# Altium schematic sheet dv_mcu.SchDoc: =GlobalProjectName
size 410 x 297 mm; SheetNumber: 1; SheetTotal: 6; PageSetup: Record=PageOptions|CenterHorizontal=True|CenterVertical=True|PrintScale=1.00|XCorrection=1.00|YCorrection=1.00|PrintKind=1|BorderSize=5000000|LeftOffset=0|BottomOffset=0|Orientation=2|PaperLength=1000|PaperWidth=1000|Scale=100|PaperSource=15|PrintQuality=1200|MediaType=1|DitherType=10|PaperKind=A3|PrintScaleMode=1; Weight: -; ScaleFactor: -
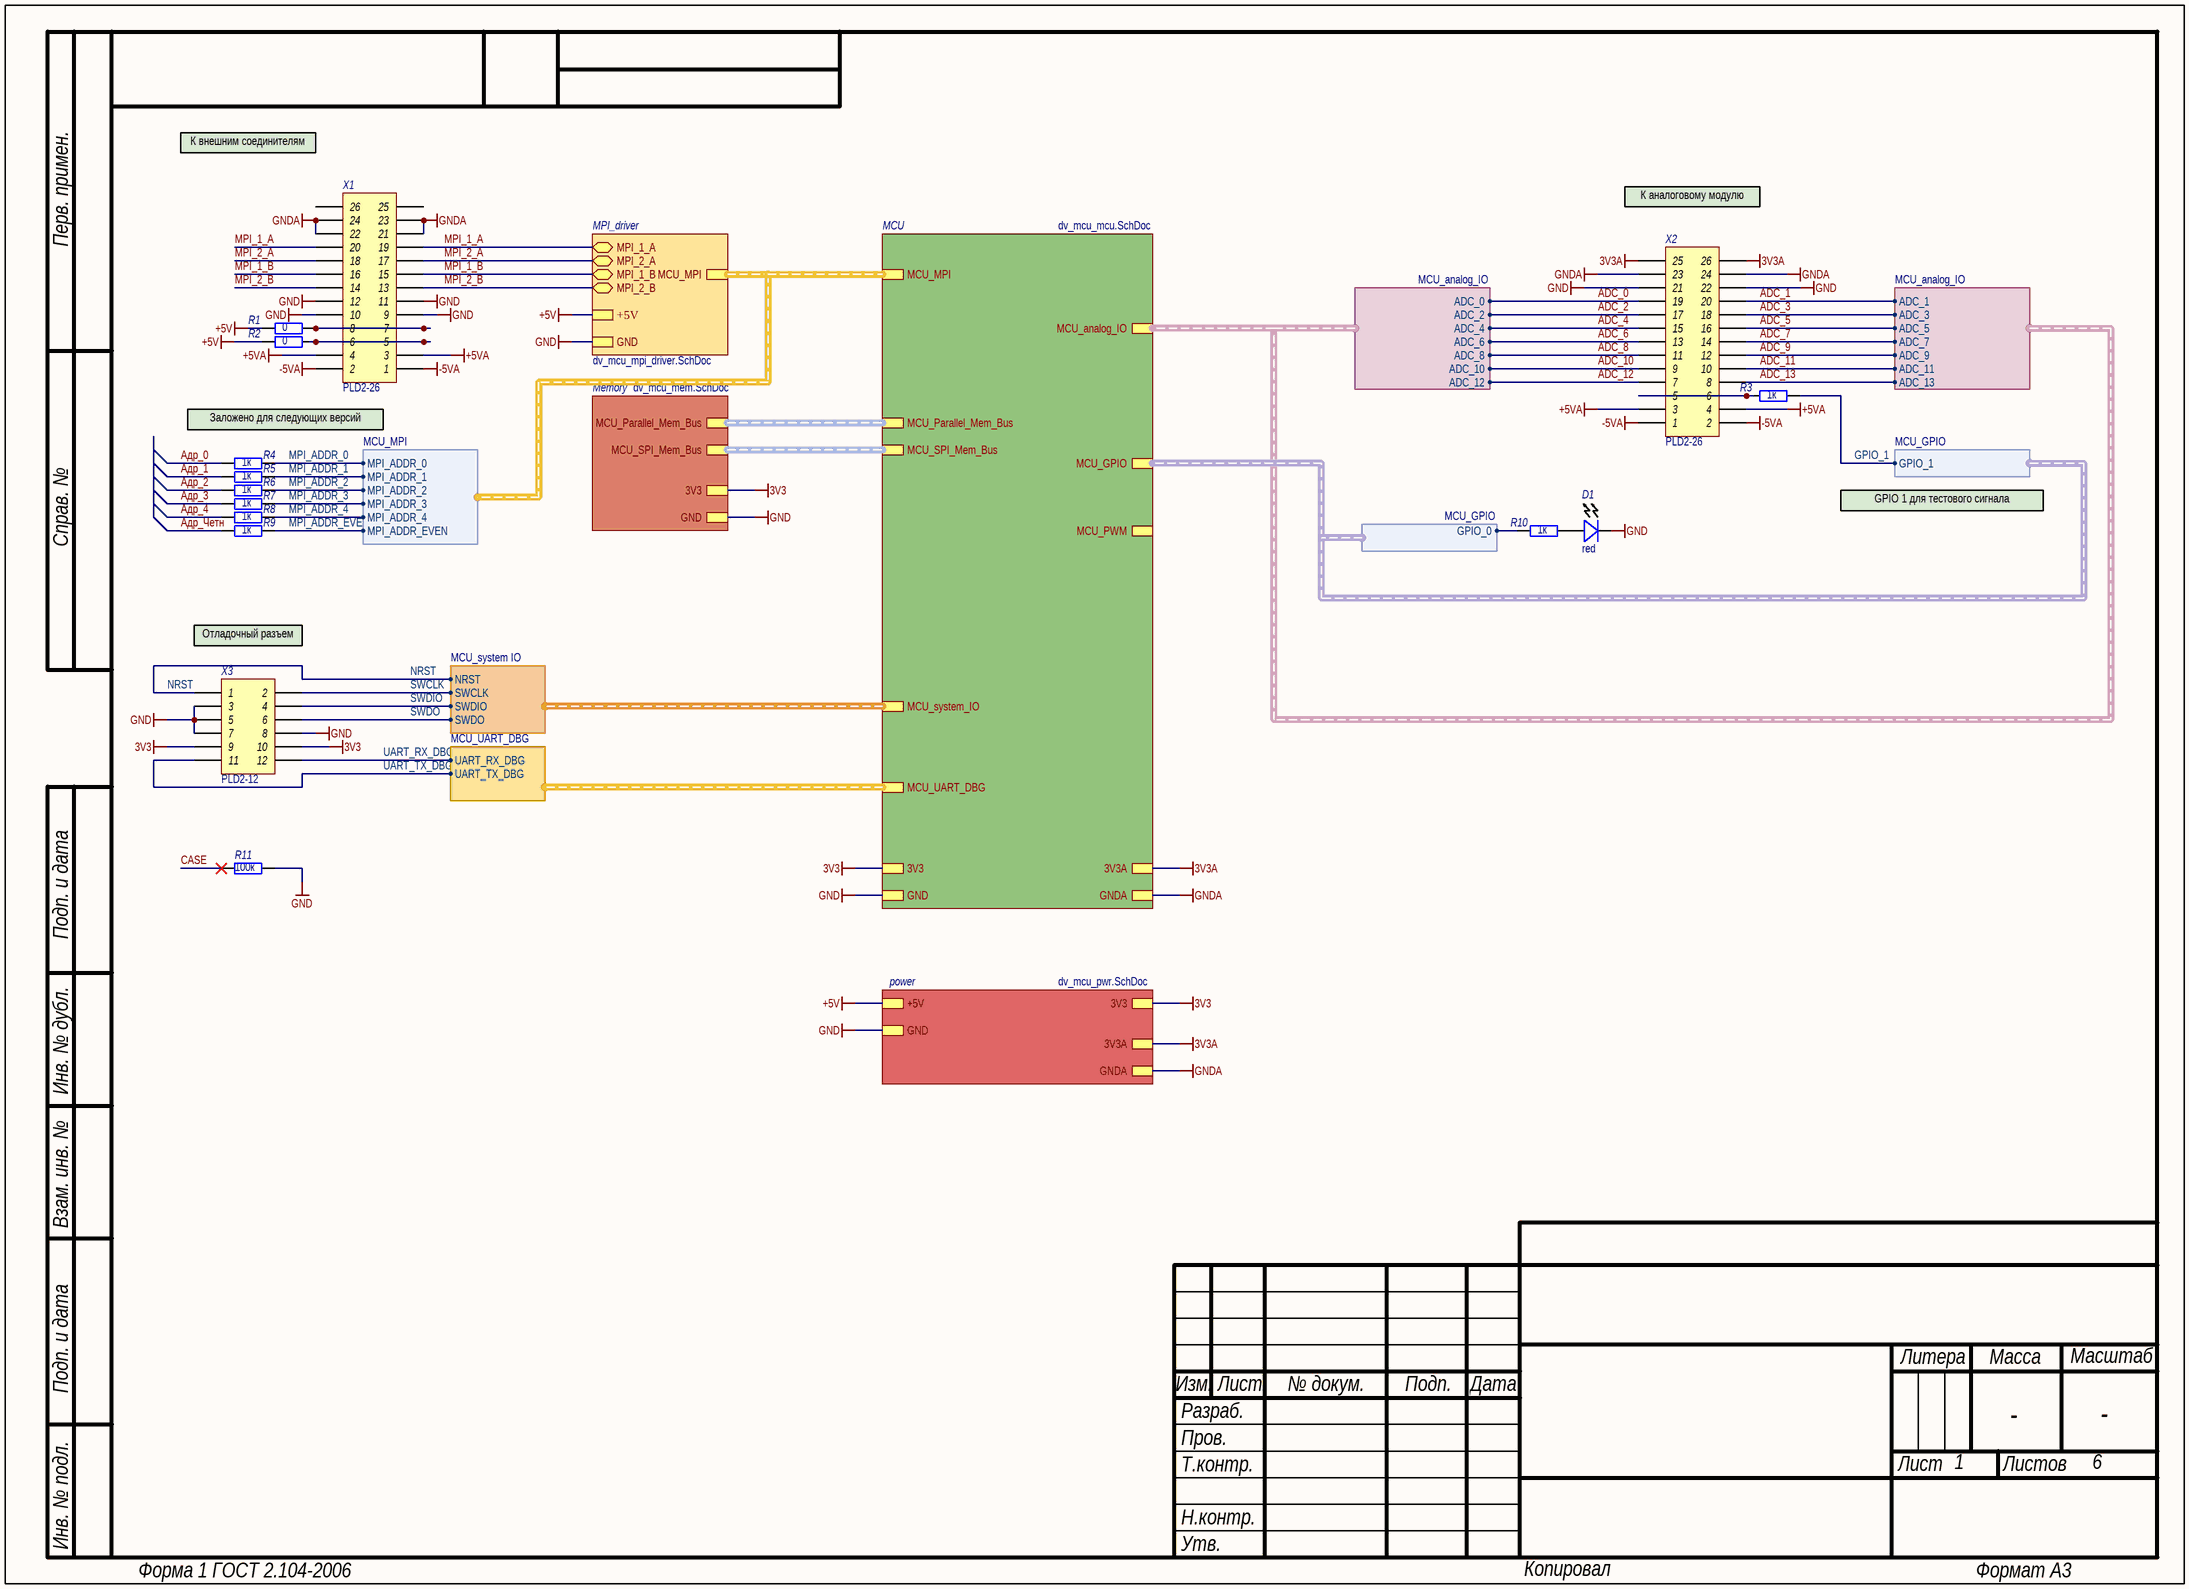
[diagram p0: dv_mcu.SchDoc]

## Parts
D1  value red  [LED-0805]  (hidden comment: LED)
R1  value 0  [SMD_0805]  (hidden comment: OSM R1-12)
R2  value 0  [SMD_0805]  (hidden comment: OSM R1-12)
R3  value 1к  [SMD_0805]  (hidden comment: OSM R1-12)
R4  value 1к  [SMD_0805]  (hidden comment: OSM R1-12)
R5  value 1к  [SMD_0805]  (hidden comment: OSM R1-12)
R6  value 1к  [SMD_0805]  (hidden comment: OSM R1-12)
R7  value 1к  [SMD_0805]  (hidden comment: OSM R1-12)
R8  value 1к  [SMD_0805]  (hidden comment: OSM R1-12)
R9  value 1к  [SMD_0805]  (hidden comment: OSM R1-12)
R10  value 1к  [SMD_0805]  (hidden comment: OSM R1-12)
R11  value 100к  [SMD_0805]  (hidden comment: OSM R1-12)
X1  Наименование: PLD2-26  [SD87340-26]  (hidden comment: Header 2X26)
X2  Наименование: PLD2-26  [SD87340-26]  (hidden comment: Header 2X26)
X3  Header 2X12  [PLD2-12]  (value not drawn)

## Sub-sheets
MCU = dv_mcu_mcu.SchDoc: MCU_GPIO (harness MCU_GPIO), MCU_UART_DBG (harness MCU_UART_DBG), MCU_system_IO (harness MCU_system IO), MCU_Parallel_Mem_Bus (harness MCU_MPI), MCU_MPI (harness MCU_MPI), 3V3, MCU_analog_IO (harness MCU_analog_IO), GND, MCU_SPI_Mem_Bus (harness MCU_SPI_Mem_Bus), MCU_PWM (harness MCU_PWM), 3V3A, GNDA
Memory = dv_mcu_mem.SchDoc: MCU_Parallel_Mem_Bus (harness MCU_MPI), MCU_SPI_Mem_Bus (harness MCU_SPI_Mem_Bus), GND, 3V3
MPI_driver = dv_mcu_mpi_driver.SchDoc: GND, MCU_MPI (harness MCU_MPI), MPI_2_B (bidir), MPI_2_A (bidir), MPI_1_A (bidir), MPI_1_B (bidir), +5V
power = dv_mcu_pwr.SchDoc: 3V3, +5V, 3V3A, GNDA, GND

## Harnesses
MCU_system IO: SWDO, SWDIO, SWCLK, NRST
MCU_UART_DBG: UART_TX_DBG, UART_RX_DBG
MCU_analog_IO: ADC_0, ADC_2, ADC_4, ADC_6, ADC_10, ADC_8, ADC_12
MCU_analog_IO: ADC_1, ADC_3, ADC_5, ADC_7, ADC_11, ADC_9, ADC_13
MCU_MPI: MPI_ADDR_0, MPI_ADDR_1, MPI_ADDR_2, MPI_ADDR_3, MPI_ADDR_4, MPI_ADDR_EVEN
MCU_GPIO: GPIO_1
MCU_GPIO: GPIO_0

## Nets
3V3: X3.9 X3.10 ; sheet MCU/3V3, sheet Memory/3V3, sheet power/3V3
3V3A: X2.25 X2.26 ; sheet MCU/3V3A, sheet power/3V3A
+5V: R1.1 R2.1 ; sheet MPI_driver/+5V, sheet power/+5V
+5VA: X1.3 X1.4 X2.3 X2.4
-5VA: X1.1 X1.2 X2.1 X2.2
GND: D1.2(K) R11.2 X1.9 X1.10 X1.11 X1.12 X2.21 X2.22 X3.3 X3.5 X3.7 X3.8 ; sheet MCU/GND, sheet Memory/GND, sheet MPI_driver/GND, sheet power/GND
GNDA: X1.21 X1.22 X1.23 X1.24 X2.23 X2.24 ; sheet MCU/GNDA, sheet power/GNDA
ADC_0: X2.19 ; sheet MCU/MCU_analog_IO.ADC_0
ADC_1: X2.20 ; sheet MCU/MCU_analog_IO.ADC_1
ADC_2: X2.17 ; sheet MCU/MCU_analog_IO.ADC_2
ADC_3: X2.18 ; sheet MCU/MCU_analog_IO.ADC_3
ADC_4: X2.15 ; sheet MCU/MCU_analog_IO.ADC_4
ADC_5: X2.16 ; sheet MCU/MCU_analog_IO.ADC_5
ADC_6: X2.13 ; sheet MCU/MCU_analog_IO.ADC_6
ADC_7: X2.14 ; sheet MCU/MCU_analog_IO.ADC_7
ADC_8: X2.11 ; sheet MCU/MCU_analog_IO.ADC_8
ADC_9: X2.12 ; sheet MCU/MCU_analog_IO.ADC_9
ADC_10: X2.9 ; sheet MCU/MCU_analog_IO.ADC_10
ADC_11: X2.10 ; sheet MCU/MCU_analog_IO.ADC_11
ADC_12: X2.7 ; sheet MCU/MCU_analog_IO.ADC_12
ADC_13: X2.8 ; sheet MCU/MCU_analog_IO.ADC_13
CASE: R11.1
GPIO_1: R3.2 ; sheet MCU/MCU_GPIO.GPIO_1
MPI_1_A: X1.19 X1.20 ; sheet MPI_driver/MPI_1_A
MPI_1_B: X1.15 X1.16 ; sheet MPI_driver/MPI_1_B
MPI_2_A: X1.17 X1.18 ; sheet MPI_driver/MPI_2_A
MPI_2_B: X1.13 X1.14 ; sheet MPI_driver/MPI_2_B
MPI_ADDR_0: R4.2 ; sheet MCU/MCU_MPI.MPI_ADDR_0
MPI_ADDR_1: R5.2 ; sheet MCU/MCU_MPI.MPI_ADDR_1
MPI_ADDR_2: R6.2 ; sheet MCU/MCU_MPI.MPI_ADDR_2
MPI_ADDR_3: R7.2 ; sheet MCU/MCU_MPI.MPI_ADDR_3
MPI_ADDR_4: R8.2 ; sheet MCU/MCU_MPI.MPI_ADDR_4
MPI_ADDR_EVEN: R9.2 ; sheet MCU/MCU_MPI.MPI_ADDR_EVEN
NRST: X3.1 ; sheet MCU/MCU_system_IO.NRST
SWCLK: X3.2 ; sheet MCU/MCU_system_IO.SWCLK
SWDIO: X3.4 ; sheet MCU/MCU_system_IO.SWDIO
SWDO: X3.6 ; sheet MCU/MCU_system_IO.SWDO
UART_RX_DBG: X3.12 ; sheet MCU/MCU_UART_DBG.UART_RX_DBG
UART_TX_DBG: X3.11 ; sheet MCU/MCU_UART_DBG.UART_TX_DBG
Адр_0: R4.1
Адр_1: R5.1
Адр_2: R6.1
Адр_3: R7.1
Адр_4: R8.1
Адр_Четн: R9.1
NetD1_1: D1.1(A) R10.2
NetR1_2: R1.2 X1.7 X1.8
NetR2_2: R2.2 X1.5 X1.6
NetR3_1: R3.1 X2.5 X2.6
NetR10_1: R10.1 ; sheet MCU/MCU_GPIO.GPIO_0

Not connected (* = marked no-connect by the designer): X1 25 26

## Buses and harness runs
harness sheet MCU/MCU_MPI = sheet MPI_driver/MCU_MPI
harness sheet MCU/MCU_Parallel_Mem_Bus = sheet Memory/MCU_Parallel_Mem_Bus
harness sheet MCU/MCU_SPI_Mem_Bus = sheet Memory/MCU_SPI_Mem_Bus

## Notes on the sheet
- К внешним соединителям
- К аналоговому модулю
- Заложено для следующих версий
- GPIO 1 для тестового сигнала
- (near X3) Отладочный разъем
- Перв. примен.
- Справ. №
- Подп. и дата
- Инв. № дубл.
- Взам. инв. №
- Изм.
- Разраб.
- Лист
- № докум.
- Подп.
- Дата
- Литера
- Масса
- Масштаб
- Пров.
- Т.контр.
- Листов
- Н.контр.
- Утв.
- Инв. № подл.
- Форма 1 ГОСТ 2.104-2006
- Копировал
- Формат А3

## Library data of the parts
D1 = LED: Назначение: Светодиод; Наименование: SMD-LED; Потребление, Вт: 0,01
R1-R11 = Resistor: Наименование: ОСМ Р1-12; Назначение: SMD-резистор; Потребление, Вт: 0,001; Точность: %
X1 X2 = Header 2X26: Header, 26-Pin, Dual row; Назначение: Header, 20-Pin, Dual row; Потребление, Вт: 0,0
X3 = Header 2X12: Header, 12-Pin, Dual row; Потребление, Вт: 0,0; Назначение: Header, 12-Pin, Dual row; Наименование: PLD2-12